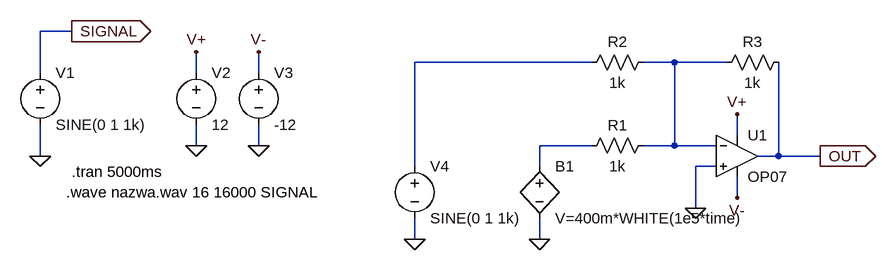
[diagram p0: schematic Filtering Noise.asc]
Filtering Noise.asc, the LTspice schematic file:
Version 4
SHEET 1 956 936
WIRE -304 32 -352 32
WIRE 496 80 224 80
WIRE 624 80 576 80
WIRE 704 80 624 80
WIRE -352 96 -352 32
WIRE -112 96 -112 64
WIRE -16 96 -16 64
WIRE 720 192 720 160
WIRE -112 208 -112 176
WIRE -16 208 -16 176
WIRE 496 208 416 208
WIRE 624 208 624 80
WIRE 624 208 576 208
WIRE 688 208 624 208
WIRE -352 224 -352 176
WIRE 784 224 784 80
WIRE 784 224 752 224
WIRE 848 224 784 224
WIRE 224 240 224 80
WIRE 416 240 416 208
WIRE 688 240 656 240
WIRE 720 288 720 256
WIRE 656 304 656 240
WIRE 224 352 224 320
WIRE 416 352 416 320
FLAG -112 208 0
FLAG -16 208 0
FLAG 224 352 0
FLAG 416 352 0
FLAG -352 224 0
FLAG -304 32 SIGNAL
IOPIN -304 32 Out
FLAG 656 304 0
FLAG 720 160 V+
FLAG 720 288 V-
FLAG -112 64 V+
FLAG -16 64 V-
FLAG 848 224 OUT
IOPIN 848 224 Out
SYMBOL voltage -352 80 R0
WINDOW 123 0 0 Left 0
WINDOW 39 0 0 Left 0
SYMATTR InstName V1
SYMATTR Value SINE(0 1 1k)
SYMBOL voltage -112 80 R0
SYMATTR InstName V2
SYMATTR Value 12
SYMBOL voltage -16 80 R0
WINDOW 123 0 0 Left 0
WINDOW 39 0 0 Left 0
SYMATTR InstName V3
SYMATTR Value -12
SYMBOL voltage 224 224 R0
WINDOW 123 0 0 Left 0
WINDOW 39 0 0 Left 0
SYMATTR InstName V4
SYMATTR Value SINE(0 1 1k)
SYMBOL bv 416 224 R0
SYMATTR InstName B1
SYMATTR Value V=400m*WHITE(1e5*time)
SYMBOL res 592 192 R90
WINDOW 0 0 56 VBottom 2
WINDOW 3 32 56 VTop 2
SYMATTR InstName R1
SYMATTR Value 1k
SYMBOL res 592 64 R90
WINDOW 0 0 56 VBottom 2
WINDOW 3 32 56 VTop 2
SYMATTR InstName R2
SYMATTR Value 1k
SYMBOL res 800 64 R90
WINDOW 0 0 56 VBottom 2
WINDOW 3 32 56 VTop 2
SYMATTR InstName R3
SYMATTR Value 1k
SYMBOL Opamps\\OP07 720 160 R0
SYMATTR InstName U1
TEXT -304 248 Left 2 !.tran 5000ms
TEXT -312 280 Left 2 !.wave nazwa.wav 16 16000 SIGNAL

The netlist it stands for:
* Filtering Noise.asc
V1 SIGNAL 0 SINE(0 1 1k)
V2 V+ 0 12
V3 V- 0 -12
V4 N001 0 SINE(0 1 1k)
B1 N003 0 V=400m*WHITE(1e5*time)
R1 N002 N003 1k
R2 N002 N001 1k
R3 OUT N002 1k
XU1 0 N002 V+ V- OUT LT1001  ; OP07, pins In+ In- V+ V- OUT
.tran 5000ms
.wave nazwa.wav 16 16000 SIGNAL
.lib LTC.lib
.backanno
.end